# EAGLE design diytextool (EAGLE 6.4)
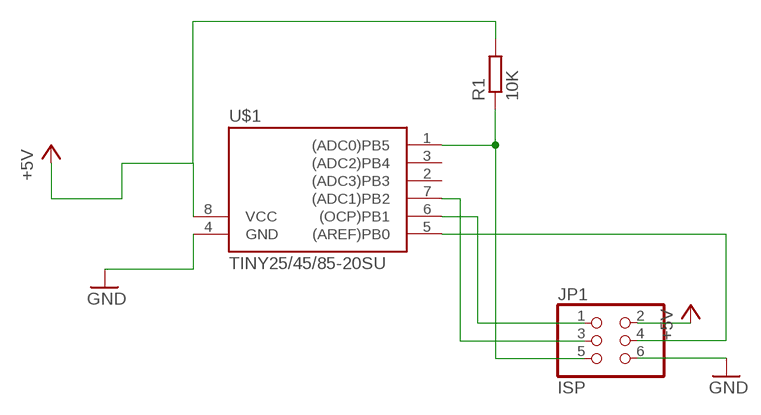
[diagram p0: schematic, sheet 1]

## Parts
JP1  ISP  PINHD-2X03_2.54-SMD  [2X03SMD]
R1  10K  R-EU_R0603  [R0603]
U$1  TINY25/45/85-20SU  [SOIC8]

## Nets
+5V: JP1.2 R1.2 U$1.8(VCC)
GND: JP1.6 U$1.4(GND)
N$2: JP1.5 R1.1 U$1.1((ADC0)PB5)
N$6: JP1.4 U$1.5((AREF)PB0)
N$7: JP1.3 U$1.7((ADC1)PB2)
N$8: JP1.1 U$1.6((OCP)PB1)
Unconnected: U$1.2((ADC3)PB3) U$1.3((ADC2)PB4)

## Library data of the parts
JP1 = pinhead-2:PINHD-2X03: PIN HEADER
R1 = resistor:R-EU_: RESISTOR, European symbol
U$1 = avr-7:TINY25/45/85

## Net classes
0 default: clearance 0.355 mm

## Board
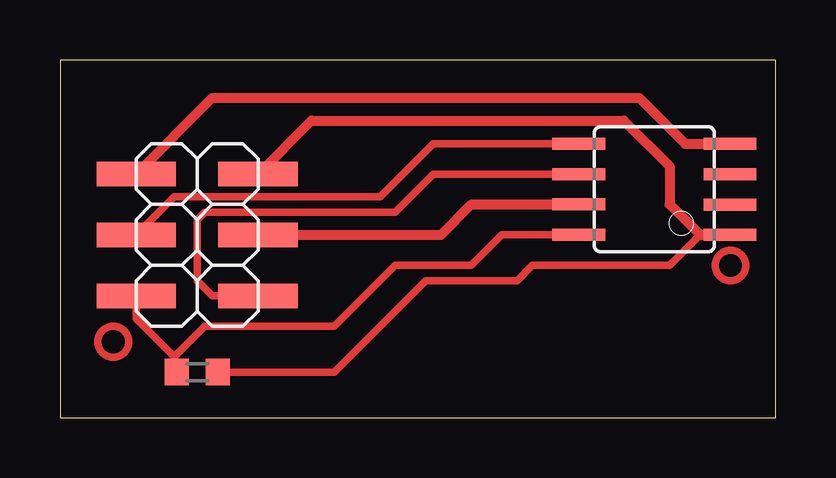
[diagram p1: board, top side]

Size 29.82 x 14.91 mm. Coordinates in mm from the lower left corner, seen from the top.
Outline: 0,0 29.82,0 29.82,14.91 0,14.91 0,0
Copper layers (1*16): Top 0.035mm / dielectric 1.5mm / Bottom 0.035mm
Design rules "default": minimum track width 10mil, minimum drill 24mil, track to track 8mil, track to pad 8mil, pad to pad 8mil, via to via 8mil, smd to smd 8mil, copper to edge 40mil, drill to drill 8mil, minimum pad ring 10mil, minimum via ring 8mil, stop-mask expansion 4mil, vias tented up to drill 0mil, thermal gap 10mil

### Footprints (pad centres in the part's own frame; a part is rotated, then mirrored left to right if it is on the bottom)
2X03SMD = smd 1.016 x 3.302: 1 -1.27,-3.81; 2 -1.27,1.27; 3 1.27,-3.81; 4 1.27,1.27; 5 3.81,-3.81; 6 3.81,1.27
R0603 = smd 1 x 1.1: 1 -0.85,0; 2 0.85,0
SOIC8 = smd 0.5 x 2.2: 1 -1.905,-3.154; 2 -0.645,-3.154; 3 0.625,-3.154; 4 1.895,-3.154; 5 1.905,3.154; 6 0.635,3.154; 7 -0.635,3.154; 8 -1.905,3.154

### Placement (x,y rotation side)
JP1  4.44,6.35 90 top
R1  5.71,1.9 180 top
U$1  24.77,9.52 90 top

### Tracks (layer width: path | path; a pad name or v marks a point on that pad's centre or on a via)
+5V
  Top 0.305: R1.2 4.76,2.01 4.76,2.54 | 4.76,2.54 3.17,4.13 JP1.2 | 4.76,2.54 6.03,3.81 11.43,3.81 13.97,6.35 17.14,6.35 18.41,7.62 U$1.8
GND
  Top 0.406: JP1.6 6.35,13.34 24.13,13.34 26.04,11.42 U$1.4
N$2
  Top 0.305: 26.67,7.62 25.4,6.35 19.69,6.35 19.05,5.71 15.24,5.71 11.43,1.9 R1.1
  Top 0.406: JP1.5 10.48,12.38 23.49,12.38 25.4,10.48 25.4,8.89 26.67,7.62 U$1.1
N$6
  Top 0.305: JP1.4 4.76,9.21 13.33,9.21 15.56,11.43 U$1.5
N$7
  Top 0.406: JP1.3 15.87,7.62 17.14,8.89 U$1.7
N$8
  Top 0.305: JP1.1 6.35,5.08 5.71,5.71 5.71,8.25 6.03,8.57 13.97,8.57 15.56,10.16 U$1.6
(copper drawn outside any net)
  shapes: Top circle x2